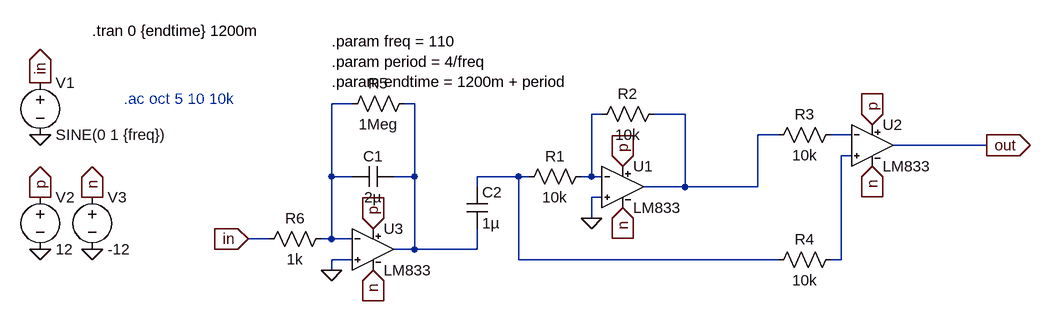
[diagram p0: schematic comparator-balanced-shifted.asc]
comparator-balanced-shifted.asc, the LTspice schematic file:
Version 4
SHEET 1 1396 680
WIRE 336 240 304 240
WIRE 432 240 416 240
WIRE 720 256 704 256
WIRE 848 256 800 256
WIRE 992 288 960 288
WIRE 1104 288 1072 288
WIRE 1312 304 1168 304
WIRE 1104 320 1088 320
WIRE 304 352 304 240
WIRE 336 352 304 352
WIRE 432 352 432 240
WIRE 432 352 400 352
WIRE 592 352 528 352
WIRE 608 352 592 352
WIRE 704 352 704 256
WIRE 704 352 688 352
WIRE 720 352 704 352
WIRE 528 368 528 352
WIRE 848 368 848 256
WIRE 848 368 784 368
WIRE 960 368 960 288
WIRE 960 368 848 368
WIRE 720 384 704 384
WIRE 704 416 704 384
WIRE 208 448 176 448
WIRE 304 448 304 352
WIRE 304 448 288 448
WIRE 336 448 304 448
WIRE 432 464 432 352
WIRE 432 464 400 464
WIRE 528 464 528 432
WIRE 528 464 432 464
WIRE 336 480 304 480
WIRE 592 480 592 352
WIRE 992 480 592 480
WIRE 1088 480 1088 320
WIRE 1088 480 1072 480
WIRE 304 496 304 480
FLAG -144 288 0
FLAG -144 464 0
FLAG -64 464 0
FLAG -144 384 p
IOPIN -144 384 Out
FLAG -64 384 n
IOPIN -64 384 Out
FLAG 1136 272 p
IOPIN 1136 272 In
FLAG 1136 336 n
IOPIN 1136 336 In
FLAG -144 208 in
IOPIN -144 208 Out
FLAG 176 448 in
IOPIN 176 448 In
FLAG 1312 304 out
IOPIN 1312 304 Out
FLAG 752 336 p
IOPIN 752 336 In
FLAG 752 400 n
IOPIN 752 400 In
FLAG 704 416 0
FLAG 368 496 n
IOPIN 368 496 In
FLAG 368 432 p
IOPIN 368 432 In
FLAG 304 496 0
SYMBOL Voltage -144 192 R0
SYMATTR InstName V1
SYMATTR Value SINE(0 1 {freq})
SYMATTR Value2 AC 1
SYMBOL Voltage -144 368 R0
SYMATTR InstName V2
SYMATTR Value 12
SYMBOL Voltage -64 368 R0
SYMATTR InstName V3
SYMATTR Value -12
SYMBOL Res 704 336 R90
WINDOW 0 0 56 VBottom 2
WINDOW 3 32 56 VTop 2
SYMATTR InstName R1
SYMATTR Value 10k
SYMBOL Res 816 240 R90
WINDOW 0 0 56 VBottom 2
WINDOW 3 32 56 VTop 2
SYMATTR InstName R2
SYMATTR Value 10k
SYMBOL Res 1088 272 R90
WINDOW 0 0 56 VBottom 2
WINDOW 3 32 56 VTop 2
SYMATTR InstName R3
SYMATTR Value 10k
SYMBOL Res 1088 464 R90
WINDOW 0 0 56 VBottom 2
WINDOW 3 32 56 VTop 2
SYMATTR InstName R4
SYMATTR Value 10k
SYMBOL LM833 752 304 R0
SYMATTR InstName U1
SYMBOL LM833 1136 240 R0
SYMATTR InstName U2
SYMBOL LM833 368 400 R0
SYMATTR InstName U3
SYMBOL Cap 400 336 R90
WINDOW 0 0 32 VBottom 2
WINDOW 3 32 32 VTop 2
SYMATTR InstName C1
SYMATTR Value 2µ
SYMBOL Res 432 224 R90
WINDOW 0 0 56 VBottom 2
WINDOW 3 32 56 VTop 2
SYMATTR InstName R5
SYMATTR Value 1Meg
SYMBOL Res 304 432 R90
WINDOW 0 0 56 VBottom 2
WINDOW 3 32 56 VTop 2
SYMATTR InstName R6
SYMATTR Value 1k
SYMBOL Cap 512 368 R0
SYMATTR InstName C2
SYMATTR Value 1µ
TEXT -64 128 Left 2 !.tran 0 {endtime} 1200m
TEXT -16 232 Left 2 ;.ac oct 5 10 10k
TEXT 304 144 Left 2 !.param freq = 110\n.param period = 4/freq\n.param endtime = 1200m + period

The netlist it stands for:
* comparator-balanced-shifted.asc
V1 in 0 SINE(0 1 {freq}) AC 1
V2 p 0 12
V3 n 0 -12
R1 N003 N007 10k
R2 N004 N003 10k
R3 N005 N004 10k
R4 N006 N007 10k
XU1 0 N003 p n N004 LM833  ; pins In+ In- V+ V- OUT
XU2 N006 N005 p n out LM833  ; pins In+ In- V+ V- OUT
XU3 0 N001 p n N002 LM833  ; pins In+ In- V+ V- OUT
C1 N002 N001 2µ
R5 N002 N001 1Meg
R6 N001 in 1k
C2 N007 N002 1µ
.tran 0 {endtime} 1200m
* .ac oct 5 10 10k
.param freq = 110
.param period = 4/freq
.param endtime = 1200m + period
.lib LM833.sub
.backanno
.end